# EAGLE design TinyNES_RGB_Board (EAGLE 9.6.2)
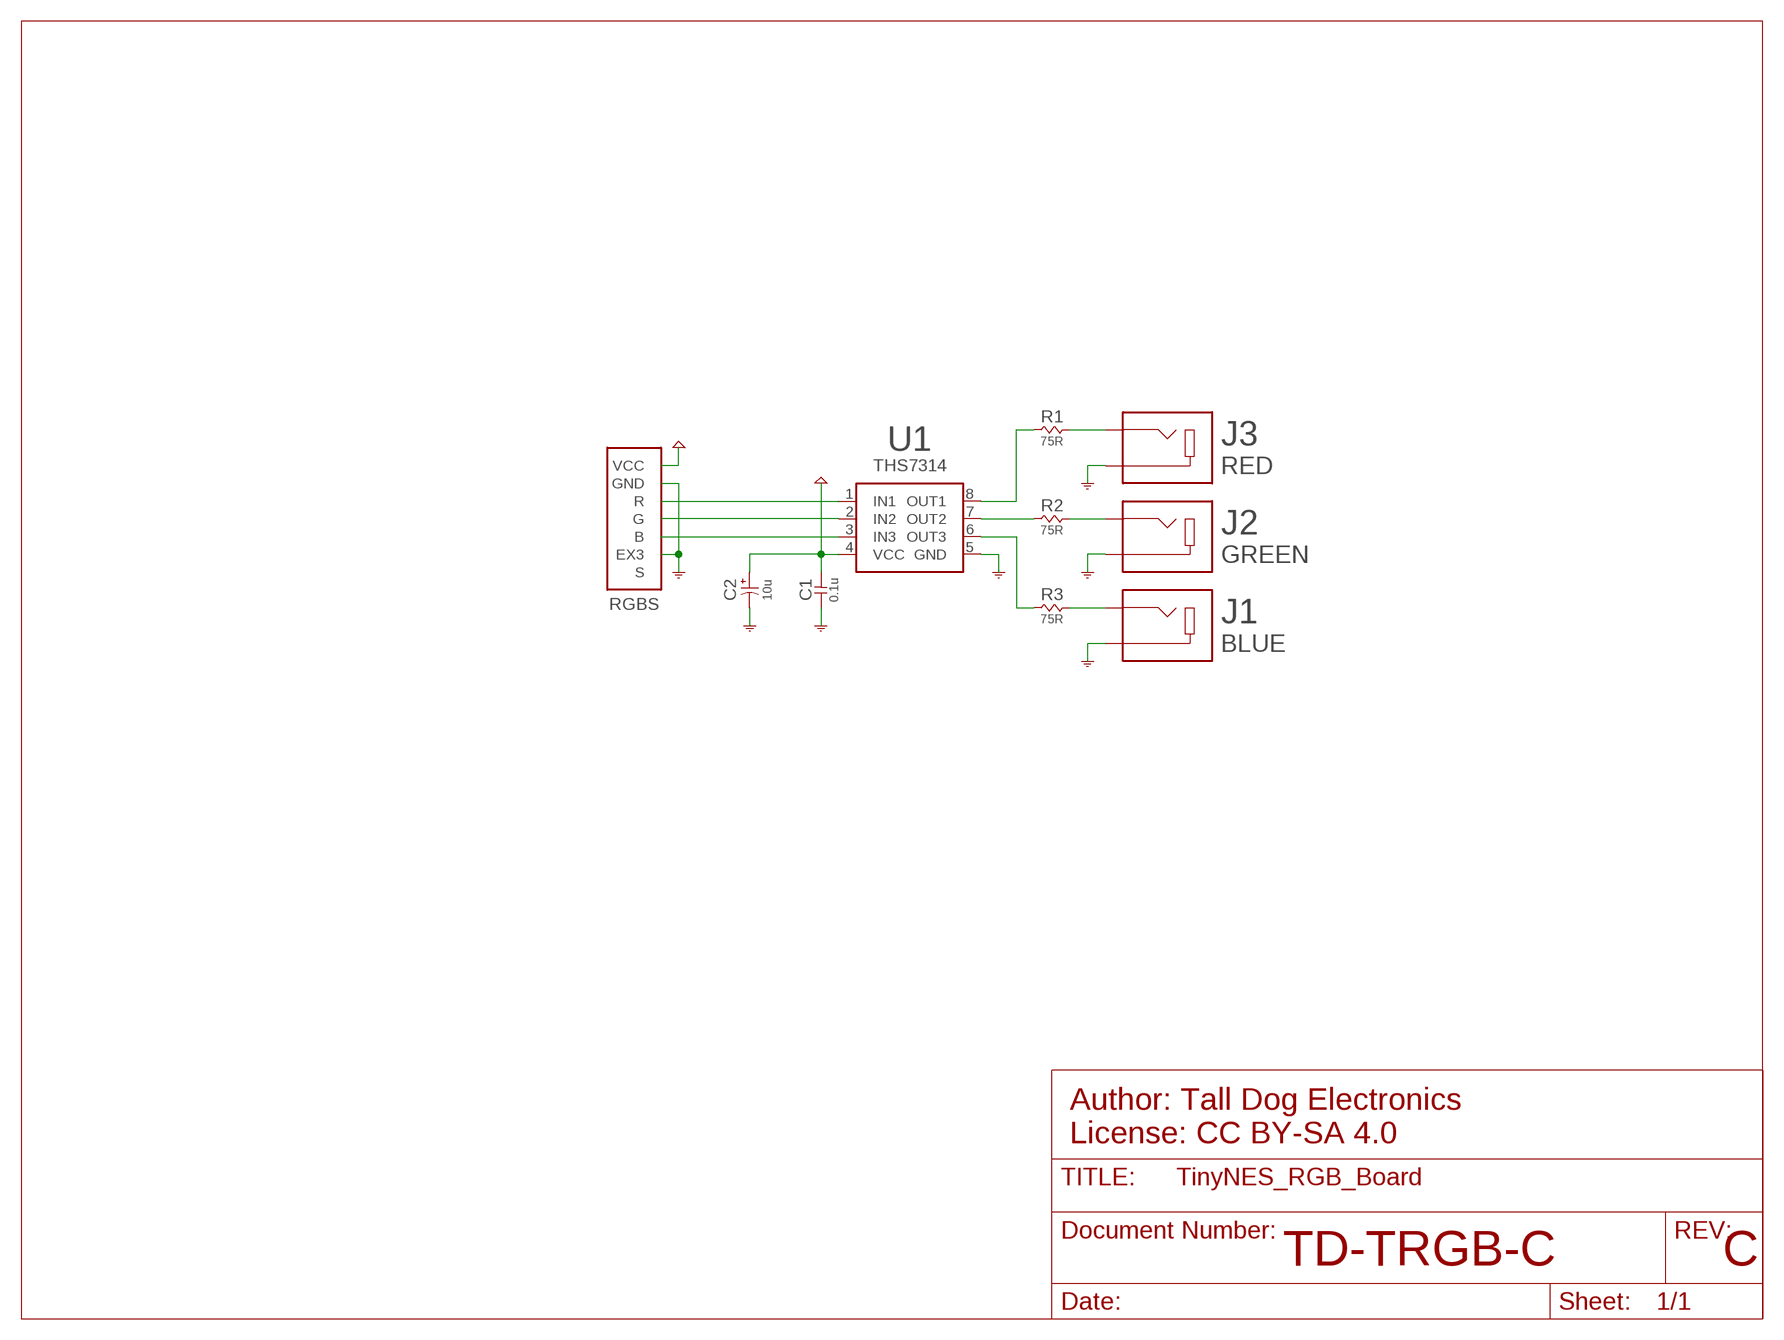
[diagram p0: schematic, sheet 1]

## Parts
C1  0.1u  CAP-NP-0805  [0805-NP]
C2  10u  CAP-P-1206  [1206-P]
J1  BLUE  JACK-VERT  [RCJ-VERT]
J2  GREEN  JACK-VERT  [RCJ-VERT]
J3  RED  JACK-VERT  [RCJ-VERT]
R1  75R  RESISTOR-0805  [0805-NP]
R2  75R  RESISTOR-0805  [0805-NP]
R3  75R  RESISTOR-0805  [0805-NP]
RGBS  RGB-BOT  [RGB-BOT]
U1  THS7314  [SOIC-8]

## Nets
GND: C1.2 C2.N(C) J1.1(S) J1.3(S) J2.1(S) J2.3(S) J3.1(S) J3.3(S) RGBS.EXT3(EX3) RGBS.GND U1.5(GND)
N$1: RGBS.R U1.1(IN1)
N$2: R3.1 U1.6(OUT3)
N$3: J3.2(T) R1.2
N$4: R1.1 U1.8(OUT1)
N$5: RGBS.G U1.2(IN2)
N$6: RGBS.B U1.3(IN3)
N$8: J2.2(T) R2.2
N$19: R2.1 U1.7(OUT2)
N$20: J1.2(T) R3.2
VCC: C1.1 C2.P(A) RGBS.VCC@1(VCC) RGBS.VCC@2(VCC) RGBS.VCC@3(VCC) U1.4(VCC)
Unconnected: RGBS.S

## Notes on the sheet
- Author: Tall Dog Electronics
  License: CC BY-SA 4.0
- TD-TRGB-C | C

## Library data of the parts
C1 = TinyNES_Library:CAP-NP
C2 = TinyNES_Library:CAP-P
J1-J3 = TinyNES_Library:JACK
R1-R3 = TinyNES_Library:RESISTOR
RGBS = TinyNES_Library:RGB
U1 = TinyNES_Library:THS7314

## Board
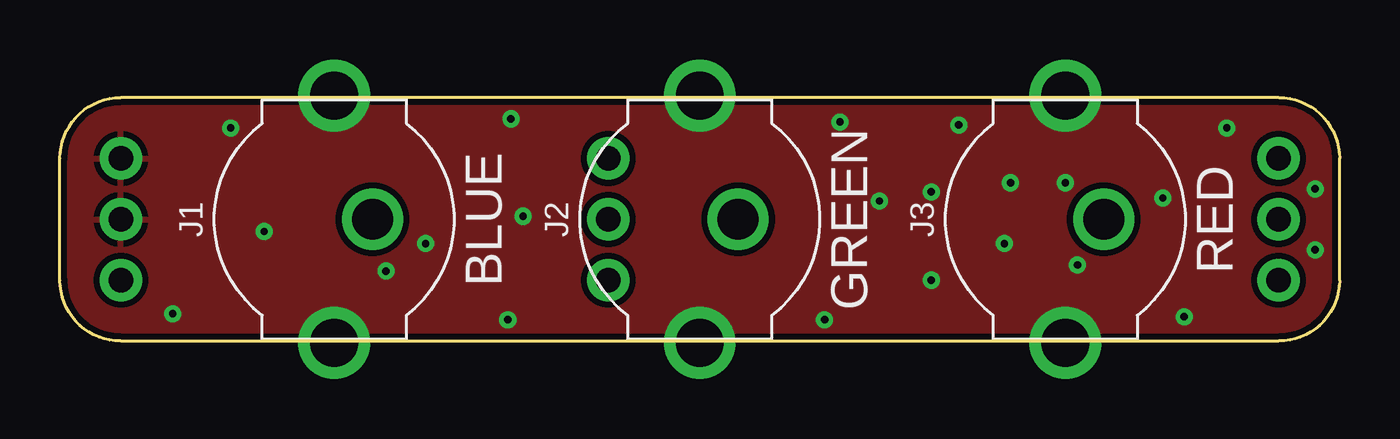
[diagram p1: board, top side]
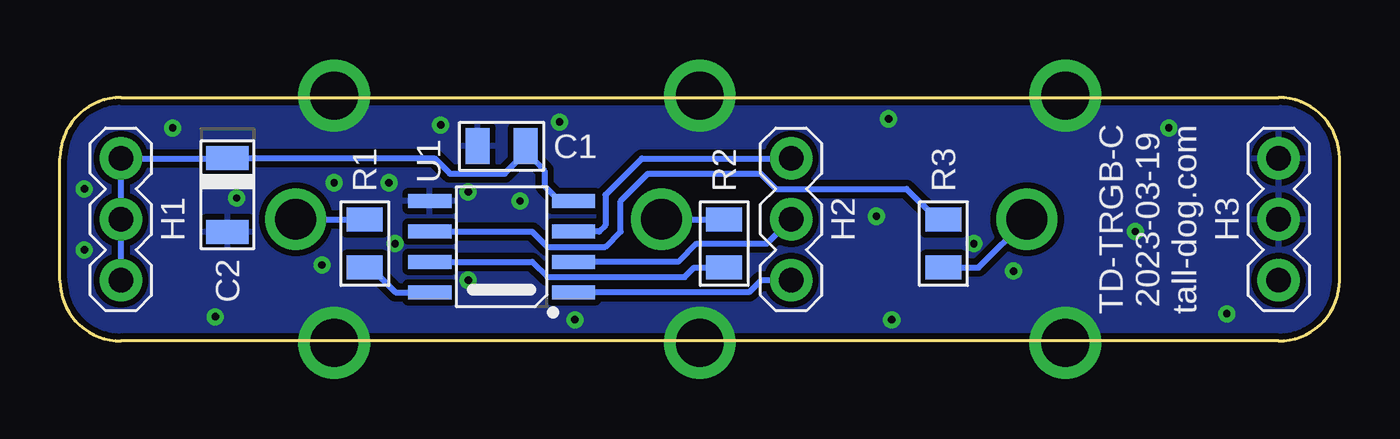
[diagram p2: board, bottom side, seen from below]

Size 53.34 x 10.16 mm. Coordinates in mm from the lower left corner, seen from the top.
Outline: 2.54,0 50.8,0 arc90 53.34,2.54 53.34,7.62 arc90 50.8,10.16 2.54,10.16 arc90 0,7.62 0,2.54 arc90 2.54,0
Copper layers (1*16): Top 0.035mm / dielectric 1.5mm / Bottom 0.035mm
Design rules "default *": minimum track width 10mil, minimum drill 12mil, track to track 8mil, track to pad 8mil, pad to pad 8mil, via to via 8mil, smd to smd 8mil, copper to edge 8mil, drill to drill 8mil, minimum pad ring 8mil, minimum via ring 8mil, stop-mask expansion 0mil, vias tented up to drill 12mil, thermal gap 10mil

### Footprints (pad centres in the part's own frame; a part is rotated, then mirrored left to right if it is on the bottom)
0805-NP = smd 1 x 1.5: 1 -1,0; 2 1,0
1206-P = smd 1 x 1.77: N 1.535,0; P -1.535,0
RCJ-VERT = drill 2: 1 -5.15,0; 3 5.15,0 | drill 1.7: 2 0,1.6
RGB-BOT = drill 1.016 pad 1.778: B -3.81,2.54; EXT3 -24.13,2.54; G -3.81,0; GND -24.13,0; R -3.81,-2.54; S -24.13,-2.54; VCC@1 24.13,2.54; VCC@2 24.13,0; VCC@3 24.13,-2.54
SOIC-8 = smd 0.6 x 1.8: 1 -1.905,-3; 2 -0.635,-3; 3 0.635,-3; 4 1.905,-3; 5 1.905,3; 6 0.635,3; 7 -0.635,3; 8 -1.905,3

### Placement (x,y rotation side)
C1  34.92,8.13 180 bottom
C2  46.35,6.1 270 bottom
J1  11.43,5.08 270 top
J2  26.67,5.08 270 top
J3  41.91,5.08 270 top
R1  40.64,4.06 90 bottom
R2  25.65,4.06 90 bottom
R3  16.51,4.06 270 bottom
RGBS  26.67,5.08 0 top
U1  34.92,3.94 90 bottom

### Tracks (layer width: path | path; a pad name or v marks a point on that pad's centre or on a via)
GND  (via drill 0.3 pad 0.51)
  other vias: 34.16,5.84 39.62,6.6 36.32,2.54 37.47,9.02 32.51,9.14 18.67,0.89 15.24,4.06 13.59,2.92 31.88,0.89 39.37,4.06 42.42,3.17 45.97,5.97 46.86,1.02 48.64,8.89 52.32,6.35 52.32,3.81 41.91,6.6 36.32,6.22 8.51,4.57 19.3,5.21 4.7,1.14 18.8,9.27 7.11,8.89
  pour Bottom (isolate 0.254): 0,10.16 53.34,10.16 53.34,0 0,0
  pour Top (isolate 0.254): 0,10.16 53.34,10.16 53.34,0 0,0
N$1
  Bottom 0.254: RGBS.R 24.12,2.54 24.62,2.03 U1.1
N$2
  Bottom 0.254: U1.6 33.66,4.57 33.02,3.94 30.61,3.94 29.97,4.57 29.97,5.84 28.83,6.99 24.13,6.99 23.5,6.35 18.05,6.35 16.76,5.06 R3.1
N$3
  Bottom 0.254: R1.2 40.66,5.08 J3.2
N$4
  Bottom 0.254: U1.8 39.35,2.03 40.39,3.06 R1.1
N$5
  Bottom 0.254: RGBS.G 23.88,4.06 26.8,4.06 27.56,3.3 U1.2
N$6
  Bottom 0.254: RGBS.B 29.08,7.62 30.61,6.1 30.61,4.83 30.86,4.57 U1.3
N$8
  Bottom 0.254: J2.2 28.25,5.06 R2.2
N$19
  Bottom 0.254: U1.7 33.66,3.3 33.02,2.67 27.3,2.67 26.91,3.06 R2.1
N$20
  Bottom 0.254: R3.2 15.05,3.06 J1.2
VCC
  Bottom 0.254: RGBS.VCC@3 RGBS.VCC@2 RGBS.VCC@1 46.37,7.62 C2.P 37.73,7.63 37.08,6.99 34.8,6.99 33.92,7.86 C1.1 33.92,7.89 33.15,7.11 33.15,6.48 32.51,5.84 U1.4

### Text on the board
tPlace: BLUE | GREEN | RED
bPlace: H3 | TD-TRGB-C / 2023-03-19 / tall-dog.com | H2 | H1
bDocu: H3 | H2 | H1